# Altium schematic sheet display.SchDoc
size A4; SheetNumber: 5; SheetTotal: 5
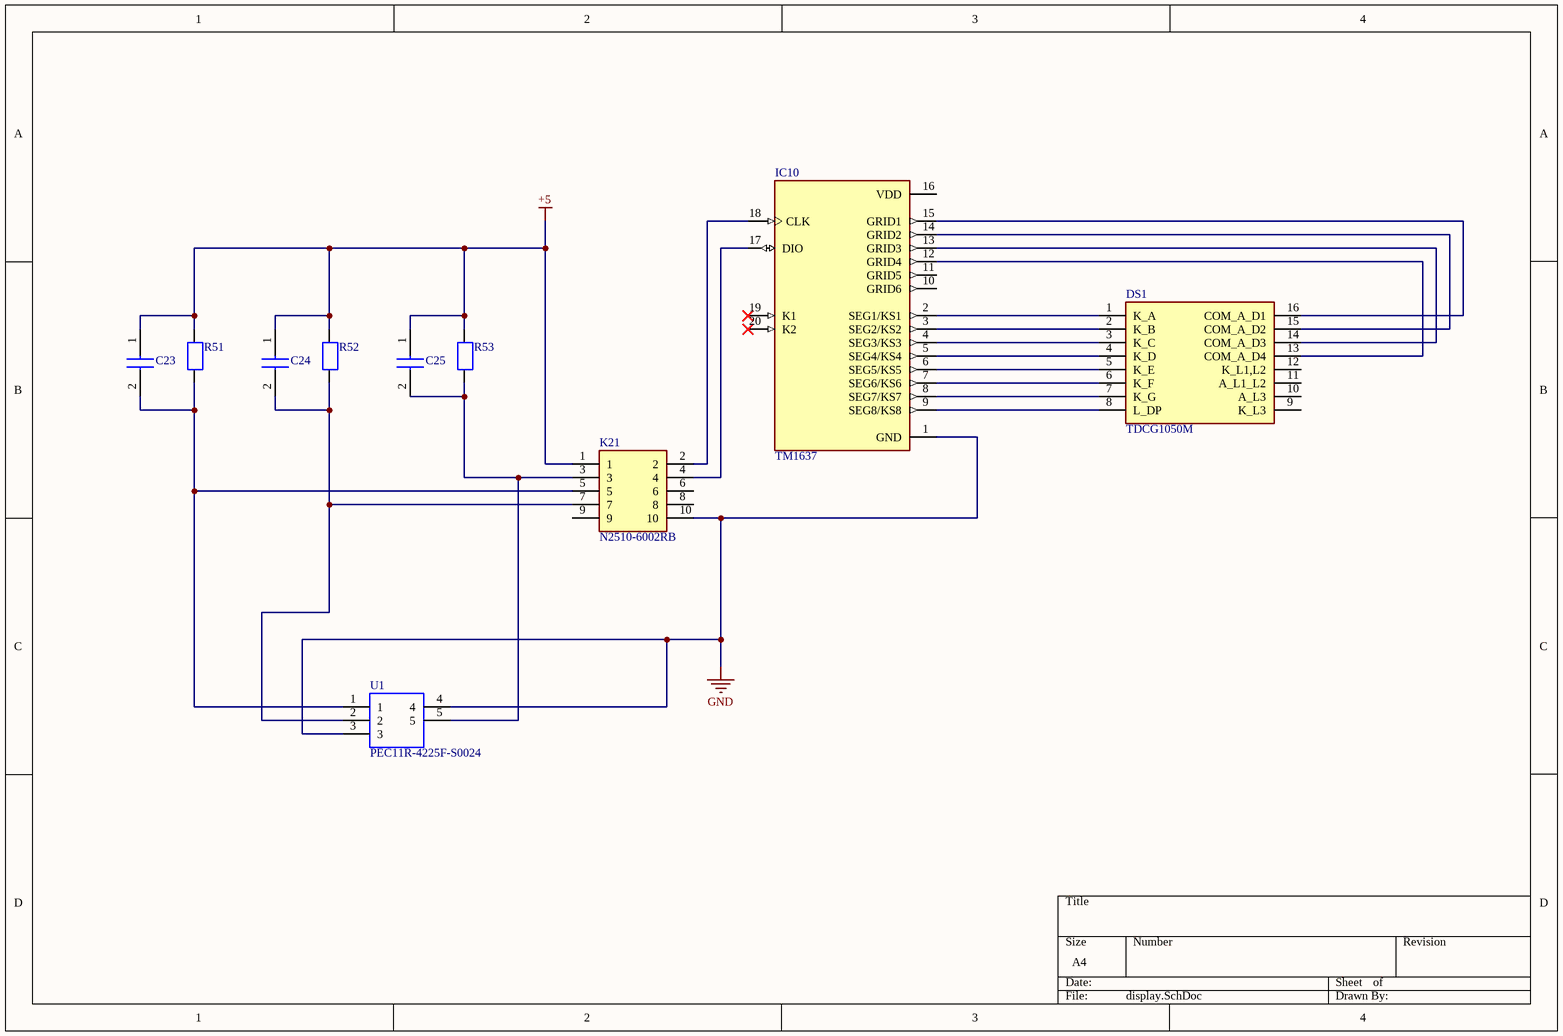
[diagram p0: display.SchDoc]

## Parts
C23  08055A130JAT2A  [CAPC2012X94N]  (value not drawn)
C24  08055A130JAT2A  [CAPC2012X94N]  (value not drawn)
C25  08055A130JAT2A  [CAPC2012X94N]  (value not drawn)
DS1  TDCG1050M  [DIPS1016W75P254L4020H725Q16N]
IC10  TM1637  [DIP778W43P254L2612H431Q20N]
K21  N2510-6002RB  [SHDR10W64P254_2X5_2002X859X991P]
R51  CRCW08050000Z0EA  [RESC2013X50X30LL20T20]  (value not drawn)
R52  CRCW08050000Z0EA  [RESC2013X50X30LL20T20]  (value not drawn)
R53  CRCW08050000Z0EA  [RESC2013X50X30LL20T20]  (value not drawn)
U1  PEC11R-4225F-S0024  [PEC12R-4XXXF-SXXXX_1]

## Nets
+5: C23.1 C24.1 C25.1 K21.1 R51.1 R52.1 R53.1
GND: IC10.1(GND) K21.10 U1.3 U1.4
NetC23_2: C23.2 K21.5 R51.2 U1.1
NetC24_2: C24.2 K21.7 R52.2 U1.2
NetC25_2: C25.2 K21.3 R53.2 U1.5
NetDS1_1: DS1.1(K_A) IC10.2(SEG1/KS1)
NetDS1_2: DS1.2(K_B) IC10.3(SEG2/KS2)
NetDS1_3: DS1.3(K_C) IC10.4(SEG3/KS3)
NetDS1_4: DS1.4(K_D) IC10.5(SEG4/KS4)
NetDS1_5: DS1.5(K_E) IC10.6(SEG5/KS5)
NetDS1_6: DS1.6(K_F) IC10.7(SEG6/KS6)
NetDS1_7: DS1.7(K_G) IC10.8(SEG7/KS7)
NetDS1_8: DS1.8(L_DP) IC10.9(SEG8/KS8)
NetDS1_13: DS1.13(COM_A_D4) IC10.12(GRID4)
NetDS1_14: DS1.14(COM_A_D3) IC10.13(GRID3)
NetDS1_15: DS1.15(COM_A_D2) IC10.14(GRID2)
NetDS1_16: DS1.16(COM_A_D1) IC10.15(GRID1)
NetIC10_17: IC10.17(DIO) K21.4
NetIC10_18: IC10.18(CLK) K21.2

Not connected (* = marked no-connect by the designer): DS1 9(K_L3) 10(A_L3) 11(A_L1_L2) 12(K_L1,L2); IC10 10(GRID6) 11(GRID5) 16(VDD) 19(K1)* 20(K2)*; K21 6 8 9

## Library data of the parts
C23-C25 = 08055A130JAT2A: Capacitor; Manufacturer_Name: AVX; Datasheet Link: https://componentsearchengine.com/Datasheets/1/06031A100FAT2A.pdf; Height: 0.94mm; Manufacturer_Part_Number: 08055A130JAT2A; Mouser Part Number: 581-08055A130JAT2A; Mouser Price/Stock: https://www.mouser.com/Search/Refine.aspx?Keyword=581-08055A130JAT2A
DS1 = TDCG1050M: Display; Manufacturer_Name: Vishay; Datasheet Link: https://www.vishay.com/docs/83180/tdcx10x0m.pdf; Height: 7.25mm; Manufacturer_Part_Number: TDCG1050M; Mouser Part Number: 78-TDCG1050; Mouser Price/Stock: https://www.mouser.co.uk/ProductDetail/Vishay-Semiconductors/TDCG1050M?qs=RzxYCzJDjPUa0IQ9xsk9iw%3D%3D; Arrow Part Number: TDCG1050M; Arrow Price/Stock: https://www.arrow.com/en/products/tdcg1050m/vishay?region=nac
IC10 = TM1637: LED Drive Control Special Circuit; MF: Titan Micro Electronics; Package: Package; Availability: Not in stock; SnapEDA_Link: https://www.snapeda.com/parts/TM1637/Titan+Micro+Electronics/view-part/?ref=snap; MP: TM1637; Check_prices: https://www.snapeda.com/parts/TM1637/Titan+Micro+Electronics/view-part/?ref=eda; Value: *; Price: None
K21 = N2510-6002RB: Connector; Manufacturer_Name: 3M; Datasheet Link: http://multimedia.3m.com/mws/media/330367O/3mtm-100-in-4-wall-hdr-rohs-lp-straightra-hitemp-ts0770.pdf?fn=TS0770.pdf; Height: 9.91mm; Manufacturer_Part_Number: N2510-6002RB; Mouser Part Number: 517-N2510-6002RB; Mouser Price/Stock: https://www.mouser.co.uk/ProductDetail/3M-Electronic-Solutions-Division/N2510-6002RB?qs=QV10cN0MjFtispGaro3M2Q%3D%3D; Arrow Part Number: N2510-6002RB; Arrow Price/Stock: https://www.arrow.com/en/products/n2510-6002-rb/3m?region=europe
R51-R53 = resistor: Manufacturer: Vishay Dale; Part Number: CRCW08050000Z0EA
U1 = PEC11R-4225F-S0024: Undefined or Miscellaneous; Manufacturer_Name: Bourns; Datasheet Link: https://componentsearchengine.com/Datasheets/1/PEC11R-4225F-S0024.pdf; Manufacturer_Part_Number: PEC11R-4225F-S0024; Mouser Part Number: 652-PEC11R-4225F-S24; Mouser Price/Stock: https://www.mouser.co.uk/ProductDetail/Bourns/PEC11R-4225F-S0024?qs=Zq5ylnUbLm4N6UNkPX3pkQ%3D%3D; Arrow Part Number: PEC11R-4225F-S0024; Arrow Price/Stock: https://www.arrow.com/en/products/pec11r-4225f-s0024/bourns?region=nac